# EAGLE schematic LiDAR_Lite_Interface (EAGLE 9.4.2)
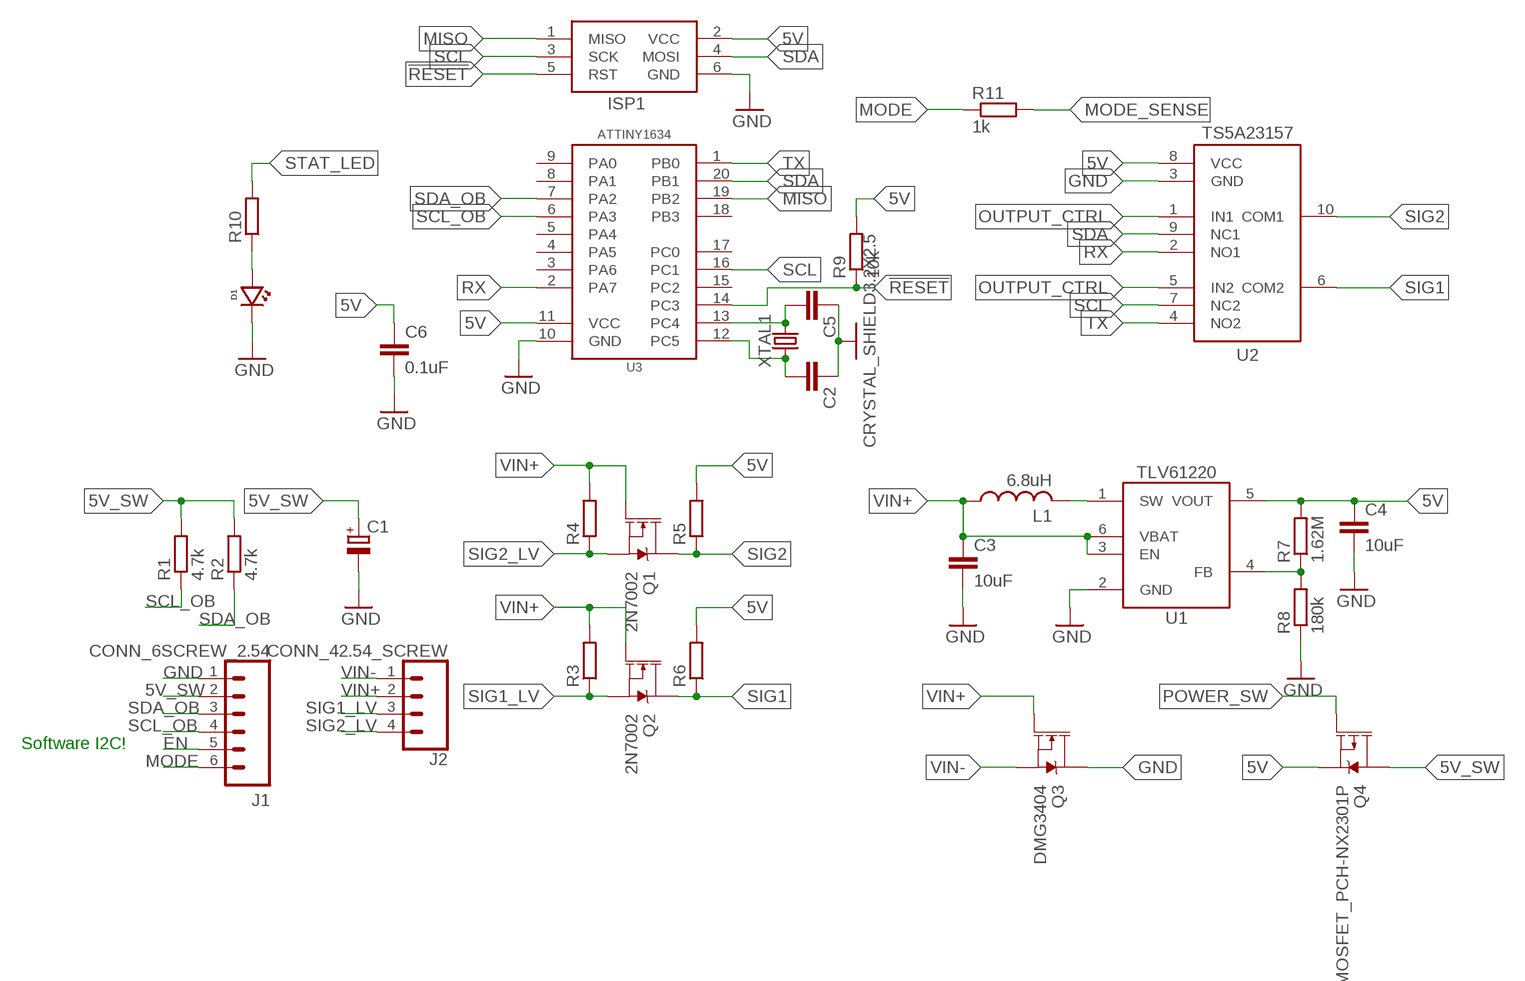
[diagram p0: schematic, sheet 1]

## Parts
C1  CPOL-EUUW-10X10  [UW-10X10_NICHICON]
C2  C-EUC0402  [C0402]
C3  10uF  C-EU10UFC0805  [C0805]
C4  10uF  C-EU10UFC0805  [C0805]
C5  C-EUC0402  [C0402]
C6  0.1uF  C-EU0.1UFC0402  [C0402]
D1  LEDBLUE0603  [LED_0603]
ISP1  AVRISP-6  [AVRISP]
J1  CONN_6SCREW_2.54  [1X06_SCREW]
J2  CONN_42.54_SCREW  [1X04_SCREW]
L1  6.8uH  INDUCTOR1008  [1008]
Q1  2N7002  MOSFET-NCH-2N7002P  [SOT23-3]
Q2  2N7002  MOSFET-NCH-2N7002P  [SOT23-3]
Q3  DMG3404  MOSFET-NCH-DMG3404L  [SOT23-3]
Q4  MOSFET_PCH-NX2301P  [SOT23-3]
R1  4.7k  R-EU_4.7KR0402  [R0402]
R2  4.7k  R-EU_4.7KR0402  [R0402]
R3  R-EU_10KR0402  [R0402]
R4  R-EU_10KR0402  [R0402]
R5  R-EU_10KR0402  [R0402]
R6  R-EU_10KR0402  [R0402]
R7  1.62M  R-EU_1.62MR0603  [R0603]
R8  180k  R-EU_180KR0603  [R0603]
R9  10k  R-EU_10KR0402  [R0402]
R10  R-EU_R0402  [R0402]
R11  1k  R-EU_1KR0402  [R0402]
U1  TLV61220DBV  [DBV_R-PDSO-G6]
U2  TS5A23157DGS  [DGS0010A]
U3  ATTINY1634SOIC  [SO-20DW]
XTAL1  CRYSTAL_SHIELD3.2X2.5  [CRYSTAL_3.2X2.5_4-SMD]

## Nets
5V: C4.1 C6.1 ISP1.2(VCC) Q4.2(S) R5.2 R6.2 R7.2 R9.2 U1.5(VOUT) U2.8(VCC) U3.11(VCC)
5V_SW: C1.+ J1.2 Q4.3(D) R1.2 R2.2
!RESET: ISP1.5(RST) R9.1 U3.14(PC3)
EN: J1.5
GND: C1.- C2.1 C3.2 C4.2 C5.1 C6.2 D1.CATHODE ISP1.6(GND) J1.1 Q3.3(D) R8.1 U1.2(GND) U2.3(GND) U3.10(GND) XTAL1.2(GND) XTAL1.4(GND)
MISO: ISP1.1(MISO) U3.19(PB2)
MODE: J1.6 R11.1
MODE_SENSE: R11.2
N$1: C5.2 U3.13(PC4) XTAL1.3
N$3: C2.2 U3.12(PC5) XTAL1.1
N$4: D1.ANODE R10.1
N$7: R7.1 R8.2 U1.4(FB)
N$9: L1.2 U1.1(SW)
OUTPUT_CTRL: U2.1(IN1) U2.5(IN2)
POWER_SW: Q4.1(G)
RX: U2.2(NO1) U3.2(PA7)
SCL: ISP1.3(SCK) U2.7(NC2) U3.16(PC1)
SCL_OB: J1.4 R1.1 U3.6(PA3)
SDA: ISP1.4(MOSI) U2.9(NC1) U3.20(PB1)
SDA_OB: J1.3 R2.1 U3.7(PA2)
SIG1: Q2.3(D) R6.1 U2.6(COM2)
SIG1_LV: J2.3 Q2.2(S) R3.1
SIG2: Q1.3(D) R5.1 U2.10(COM1)
SIG2_LV: J2.4 Q1.2(S) R4.1
STAT_LED: R10.2
TX: U2.4(NO2) U3.1(PB0)
VIN+: C3.1 J2.2 L1.1 Q1.1(G) Q2.1(G) Q3.1(G) R3.2 R4.2 U1.3(EN) U1.6(VBAT)
VIN-: J2.1 Q3.2(S)
Unconnected: U3.3(PA6) U3.4(PA5) U3.5(PA4) U3.8(PA1) U3.9(PA0) U3.15(PC2) U3.17(PC0) U3.18(PB3)

## Notes on the sheet
- Software I2C!

## Library data of the parts
C1 = bschulz_passives:CPOL-EU: POLARIZED CAPACITOR, European symbol
C2 C5 = bschulz_passives:C-EU: CAPACITOR, European symbol
C3 C4 = bschulz_passives:C-EU: CAPACITOR, European symbol; DIGIKEY: 490-6473-6-ND; MF: Murata; MPN: GRM21BR61C106KE15K
C6 = bschulz_passives:C-EU: CAPACITOR, European symbol; DIGIKEY: 490-4759-1-ND; MF: Murata; MPN: GCM155R71C104KA55D
D1 = bschulz:LED: Genaric LED; DIGIKEY: 732-4966-1-ND; MF: Wurth; MPN: 150060BS75000
ISP1 = bschulz:AVRISP: AVR ISP HEADER Standard 6 pin header for AVR programming
J1 = bschulz:CONN_6: Genaric 6 terminal header Digikey 2.54_SCREW <https://www.digikey.com/product-detail/en/on-shore-technology-inc/OSTVN06A150/ED10565-ND/1588866>; DIGIKEY: ED10565-ND; MF: OnShore; MPN: OSTVN06A150
J2 = bschulz:CONN_4: Genaric 4 terminal header Digikey 2.54_SCREW <https://www.digikey.com/product-detail/en/on-shore-technology-inc/OSTVN04A150/ED10563-ND/1588864>; DIGIKEY: ED10563-ND; MF: On Shore; MPN: OSTVN04A150
L1 = bschulz:INDUCTOR: Genaric inductor; DIGIKEY: 732-4849-1-ND; MF: Wurth; MPN: 74438323068
Q1 Q2 = bschulz:MOSFET-NCH: N-channel MOSFETs Voltage controlled devices that allow control of high current outputs. SparkFun Products: SparkFun OpenScale <https://www.sparkfun.com/products/13261> SparkFun Digital Sandbox <https://www.sparkfun.com/products/12651> SparkFun Monster Moto Shield <https://www.sparkfun.com/products/10182> SparkFun MOSFET Power Controller <https://www.sparkfun.com/products/11214>; DIGIKEY: 1727-4692-1-ND; MF: Nexperia; MPN: 2N7002P,215
Q3 = bschulz:MOSFET-NCH: N-channel MOSFETs Voltage controlled devices that allow control of high current outputs. SparkFun Products: SparkFun OpenScale <https://www.sparkfun.com/products/13261> SparkFun Digital Sandbox <https://www.sparkfun.com/products/12651> SparkFun Monster Moto Shield <https://www.sparkfun.com/products/10182> SparkFun MOSFET Power Controller <https://www.sparkfun.com/products/11214>; DIGIKEY: DMG3404L-7DICT-ND; MF: Diodes Incorporated; MPN: DMG3404L-7
Q4 = bschulz:MOSFET_PCH: P-channel MOSFETs Voltage controlled devices that allow control of high current outputs. SparkFun Products: SparkFun ESP32 Thing <https://www.sparkfun.com/products/13907> SparkFun ESP8266 Thing <https://www.sparkfun.com/products/13231>; DIGIKEY: 1727-1148-1-ND; MF: Nexperia; MPN: NX2301P,215
R1 R2 = bschulz_passives:R-EU_: RESISTOR, European symbol Digikey Parts: Yageo, 0402 <https://www.digikey.com/products/en/resistors/chip-resistor-surface-mount/52?k=&pkeyword=&sf=0&FV=ffec1104%2Cfffc000d%2C1c0002%2C440067%2C1f140000%2Cffe00034%2C400004&quantity=&ColumnSort=0&page=1&stock=1&pageSize=25> Yageo, 0603 <https://www.digikey.com/products/en/resistors/chip-resistor-surface-mount/52?k=&pkeyword=&s=4356&s=47360&sf=0&FV=fffc000d%2C1c0002%2C142c040c%2C1f140000%2Cffe00034&quantity=10&ColumnSort=1000011&page=1&stock=1&pageSize=25> Panasonic, 0603 <https://www.digikey.com/products/en/resistors/chip-resistor-surface-mount/52?k=&pkeyword=&pv252=68&sf=0&FV=ffec373d%2C1c0002%2C142c040c%2C1f140000%2Cffe00034%2C80002%2Cc0001&quantity=&ColumnSort=0&page=1&stock=1&pageSize=25> Panasonic, precision, 0603 <https://www.digikey.com/products/en/resistors/chip-resistor-surface-mount/52?FV=ffec4907%2Cfffc000a%2Cc0172%2C142c040c%2C1f140000%2Cffe00034%2C1c0002&quantity=100&ColumnSort=2085&page=1&stock=1&pageSize=25> Panasonic, 0805 <https://www.digikey.com/products/en/resistors/chip-resistor-surface-mount/52?k=&pkeyword=&pv3=1&sf=0&FV=ffec373d%2C1c0002%2C1f140000%2Cffe00034%2C142c040d&quantity=&ColumnSort=0&page=1&stock=1&pageSize=25> Rohm, current sense <https://www.digikey.com/products/en/resistors/chip-resistor-surface-mount/52?k=&pkeyword=&pv3=1&sf=0&FV=ffecb688%2C1f140000%2Cffe00034%2C1c0002&quantity=&ColumnSort=0&page=1&stock=1&pageSize=25> Vishay, pulse proof automotive <https://www.digikey.com/products/en/resistors/chip-resistor-surface-mount/52?k=&pkeyword=&pv7=2&sf=0&FV=ffec5d6b%2Cffe00034%2C1f140000&quantity=&ColumnSort=0&page=1&stock=1&pageSize=25>; DIGIKEY: 311-4.7KJRCT-ND; MF: Yageo; MPN: RC0402JR-074K7L; VALUE_PART: 4.7k
R3-R6 R9 = bschulz_passives:R-EU_: RESISTOR, European symbol Digikey Parts: Yageo, 0402 <https://www.digikey.com/products/en/resistors/chip-resistor-surface-mount/52?k=&pkeyword=&sf=0&FV=ffec1104%2Cfffc000d%2C1c0002%2C440067%2C1f140000%2Cffe00034%2C400004&quantity=&ColumnSort=0&page=1&stock=1&pageSize=25> Yageo, 0603 <https://www.digikey.com/products/en/resistors/chip-resistor-surface-mount/52?k=&pkeyword=&s=4356&s=47360&sf=0&FV=fffc000d%2C1c0002%2C142c040c%2C1f140000%2Cffe00034&quantity=10&ColumnSort=1000011&page=1&stock=1&pageSize=25> Panasonic, 0603 <https://www.digikey.com/products/en/resistors/chip-resistor-surface-mount/52?k=&pkeyword=&pv252=68&sf=0&FV=ffec373d%2C1c0002%2C142c040c%2C1f140000%2Cffe00034%2C80002%2Cc0001&quantity=&ColumnSort=0&page=1&stock=1&pageSize=25> Panasonic, precision, 0603 <https://www.digikey.com/products/en/resistors/chip-resistor-surface-mount/52?FV=ffec4907%2Cfffc000a%2Cc0172%2C142c040c%2C1f140000%2Cffe00034%2C1c0002&quantity=100&ColumnSort=2085&page=1&stock=1&pageSize=25> Panasonic, 0805 <https://www.digikey.com/products/en/resistors/chip-resistor-surface-mount/52?k=&pkeyword=&pv3=1&sf=0&FV=ffec373d%2C1c0002%2C1f140000%2Cffe00034%2C142c040d&quantity=&ColumnSort=0&page=1&stock=1&pageSize=25> Rohm, current sense <https://www.digikey.com/products/en/resistors/chip-resistor-surface-mount/52?k=&pkeyword=&pv3=1&sf=0&FV=ffecb688%2C1f140000%2Cffe00034%2C1c0002&quantity=&ColumnSort=0&page=1&stock=1&pageSize=25> Vishay, pulse proof automotive <https://www.digikey.com/products/en/resistors/chip-resistor-surface-mount/52?k=&pkeyword=&pv7=2&sf=0&FV=ffec5d6b%2Cffe00034%2C1f140000&quantity=&ColumnSort=0&page=1&stock=1&pageSize=25>; DIGIKEY: 311-10.0KHRCT-ND; MF: Yageo; MPN: RC0603FR-0710KL; VALUE_PART: 10k
R7 = bschulz_passives:R-EU_: RESISTOR, European symbol Digikey Parts: Yageo, 0402 <https://www.digikey.com/products/en/resistors/chip-resistor-surface-mount/52?k=&pkeyword=&sf=0&FV=ffec1104%2Cfffc000d%2C1c0002%2C440067%2C1f140000%2Cffe00034%2C400004&quantity=&ColumnSort=0&page=1&stock=1&pageSize=25> Yageo, 0603 <https://www.digikey.com/products/en/resistors/chip-resistor-surface-mount/52?k=&pkeyword=&s=4356&s=47360&sf=0&FV=fffc000d%2C1c0002%2C142c040c%2C1f140000%2Cffe00034&quantity=10&ColumnSort=1000011&page=1&stock=1&pageSize=25> Panasonic, 0603 <https://www.digikey.com/products/en/resistors/chip-resistor-surface-mount/52?k=&pkeyword=&pv252=68&sf=0&FV=ffec373d%2C1c0002%2C142c040c%2C1f140000%2Cffe00034%2C80002%2Cc0001&quantity=&ColumnSort=0&page=1&stock=1&pageSize=25> Panasonic, precision, 0603 <https://www.digikey.com/products/en/resistors/chip-resistor-surface-mount/52?FV=ffec4907%2Cfffc000a%2Cc0172%2C142c040c%2C1f140000%2Cffe00034%2C1c0002&quantity=100&ColumnSort=2085&page=1&stock=1&pageSize=25> Panasonic, 0805 <https://www.digikey.com/products/en/resistors/chip-resistor-surface-mount/52?k=&pkeyword=&pv3=1&sf=0&FV=ffec373d%2C1c0002%2C1f140000%2Cffe00034%2C142c040d&quantity=&ColumnSort=0&page=1&stock=1&pageSize=25> Rohm, current sense <https://www.digikey.com/products/en/resistors/chip-resistor-surface-mount/52?k=&pkeyword=&pv3=1&sf=0&FV=ffecb688%2C1f140000%2Cffe00034%2C1c0002&quantity=&ColumnSort=0&page=1&stock=1&pageSize=25> Vishay, pulse proof automotive <https://www.digikey.com/products/en/resistors/chip-resistor-surface-mount/52?k=&pkeyword=&pv7=2&sf=0&FV=ffec5d6b%2Cffe00034%2C1f140000&quantity=&ColumnSort=0&page=1&stock=1&pageSize=25>; DIGIKEY: RMCF0603FT1M62CT-ND; MF: Stackpole; MPN: RMCF0603FT1M62; VALUE_PART: 1.62M
R8 = bschulz_passives:R-EU_: RESISTOR, European symbol Digikey Parts: Yageo, 0402 <https://www.digikey.com/products/en/resistors/chip-resistor-surface-mount/52?k=&pkeyword=&sf=0&FV=ffec1104%2Cfffc000d%2C1c0002%2C440067%2C1f140000%2Cffe00034%2C400004&quantity=&ColumnSort=0&page=1&stock=1&pageSize=25> Yageo, 0603 <https://www.digikey.com/products/en/resistors/chip-resistor-surface-mount/52?k=&pkeyword=&s=4356&s=47360&sf=0&FV=fffc000d%2C1c0002%2C142c040c%2C1f140000%2Cffe00034&quantity=10&ColumnSort=1000011&page=1&stock=1&pageSize=25> Panasonic, 0603 <https://www.digikey.com/products/en/resistors/chip-resistor-surface-mount/52?k=&pkeyword=&pv252=68&sf=0&FV=ffec373d%2C1c0002%2C142c040c%2C1f140000%2Cffe00034%2C80002%2Cc0001&quantity=&ColumnSort=0&page=1&stock=1&pageSize=25> Panasonic, precision, 0603 <https://www.digikey.com/products/en/resistors/chip-resistor-surface-mount/52?FV=ffec4907%2Cfffc000a%2Cc0172%2C142c040c%2C1f140000%2Cffe00034%2C1c0002&quantity=100&ColumnSort=2085&page=1&stock=1&pageSize=25> Panasonic, 0805 <https://www.digikey.com/products/en/resistors/chip-resistor-surface-mount/52?k=&pkeyword=&pv3=1&sf=0&FV=ffec373d%2C1c0002%2C1f140000%2Cffe00034%2C142c040d&quantity=&ColumnSort=0&page=1&stock=1&pageSize=25> Rohm, current sense <https://www.digikey.com/products/en/resistors/chip-resistor-surface-mount/52?k=&pkeyword=&pv3=1&sf=0&FV=ffecb688%2C1f140000%2Cffe00034%2C1c0002&quantity=&ColumnSort=0&page=1&stock=1&pageSize=25> Vishay, pulse proof automotive <https://www.digikey.com/products/en/resistors/chip-resistor-surface-mount/52?k=&pkeyword=&pv7=2&sf=0&FV=ffec5d6b%2Cffe00034%2C1f140000&quantity=&ColumnSort=0&page=1&stock=1&pageSize=25>; DIGIKEY: P180KHCT-ND; MF: Panasonic; MPN: ERJ-3EKF1803V; VALUE_PART: 180k
R10 = bschulz_passives:R-EU_: RESISTOR, European symbol Digikey Parts: Yageo, 0402 <https://www.digikey.com/products/en/resistors/chip-resistor-surface-mount/52?k=&pkeyword=&sf=0&FV=ffec1104%2Cfffc000d%2C1c0002%2C440067%2C1f140000%2Cffe00034%2C400004&quantity=&ColumnSort=0&page=1&stock=1&pageSize=25> Yageo, 0603 <https://www.digikey.com/products/en/resistors/chip-resistor-surface-mount/52?k=&pkeyword=&s=4356&s=47360&sf=0&FV=fffc000d%2C1c0002%2C142c040c%2C1f140000%2Cffe00034&quantity=10&ColumnSort=1000011&page=1&stock=1&pageSize=25> Panasonic, 0603 <https://www.digikey.com/products/en/resistors/chip-resistor-surface-mount/52?k=&pkeyword=&pv252=68&sf=0&FV=ffec373d%2C1c0002%2C142c040c%2C1f140000%2Cffe00034%2C80002%2Cc0001&quantity=&ColumnSort=0&page=1&stock=1&pageSize=25> Panasonic, precision, 0603 <https://www.digikey.com/products/en/resistors/chip-resistor-surface-mount/52?FV=ffec4907%2Cfffc000a%2Cc0172%2C142c040c%2C1f140000%2Cffe00034%2C1c0002&quantity=100&ColumnSort=2085&page=1&stock=1&pageSize=25> Panasonic, 0805 <https://www.digikey.com/products/en/resistors/chip-resistor-surface-mount/52?k=&pkeyword=&pv3=1&sf=0&FV=ffec373d%2C1c0002%2C1f140000%2Cffe00034%2C142c040d&quantity=&ColumnSort=0&page=1&stock=1&pageSize=25> Rohm, current sense <https://www.digikey.com/products/en/resistors/chip-resistor-surface-mount/52?k=&pkeyword=&pv3=1&sf=0&FV=ffecb688%2C1f140000%2Cffe00034%2C1c0002&quantity=&ColumnSort=0&page=1&stock=1&pageSize=25> Vishay, pulse proof automotive <https://www.digikey.com/products/en/resistors/chip-resistor-surface-mount/52?k=&pkeyword=&pv7=2&sf=0&FV=ffec5d6b%2Cffe00034%2C1f140000&quantity=&ColumnSort=0&page=1&stock=1&pageSize=25>; MF: Yageo
R11 = bschulz_passives:R-EU_: RESISTOR, European symbol Digikey Parts: Yageo, 0402 <https://www.digikey.com/products/en/resistors/chip-resistor-surface-mount/52?k=&pkeyword=&sf=0&FV=ffec1104%2Cfffc000d%2C1c0002%2C440067%2C1f140000%2Cffe00034%2C400004&quantity=&ColumnSort=0&page=1&stock=1&pageSize=25> Yageo, 0603 <https://www.digikey.com/products/en/resistors/chip-resistor-surface-mount/52?k=&pkeyword=&s=4356&s=47360&sf=0&FV=fffc000d%2C1c0002%2C142c040c%2C1f140000%2Cffe00034&quantity=10&ColumnSort=1000011&page=1&stock=1&pageSize=25> Panasonic, 0603 <https://www.digikey.com/products/en/resistors/chip-resistor-surface-mount/52?k=&pkeyword=&pv252=68&sf=0&FV=ffec373d%2C1c0002%2C142c040c%2C1f140000%2Cffe00034%2C80002%2Cc0001&quantity=&ColumnSort=0&page=1&stock=1&pageSize=25> Panasonic, precision, 0603 <https://www.digikey.com/products/en/resistors/chip-resistor-surface-mount/52?FV=ffec4907%2Cfffc000a%2Cc0172%2C142c040c%2C1f140000%2Cffe00034%2C1c0002&quantity=100&ColumnSort=2085&page=1&stock=1&pageSize=25> Panasonic, 0805 <https://www.digikey.com/products/en/resistors/chip-resistor-surface-mount/52?k=&pkeyword=&pv3=1&sf=0&FV=ffec373d%2C1c0002%2C1f140000%2Cffe00034%2C142c040d&quantity=&ColumnSort=0&page=1&stock=1&pageSize=25> Rohm, current sense <https://www.digikey.com/products/en/resistors/chip-resistor-surface-mount/52?k=&pkeyword=&pv3=1&sf=0&FV=ffecb688%2C1f140000%2Cffe00034%2C1c0002&quantity=&ColumnSort=0&page=1&stock=1&pageSize=25> Vishay, pulse proof automotive <https://www.digikey.com/products/en/resistors/chip-resistor-surface-mount/52?k=&pkeyword=&pv7=2&sf=0&FV=ffec5d6b%2Cffe00034%2C1f140000&quantity=&ColumnSort=0&page=1&stock=1&pageSize=25>; DIGIKEY: 311-1.00KLRCT-ND; MF: Yageo; MPN: RC0402FR-071KL; VALUE_PART: 1k
U1 = bschulz:TLV61220: TLV61220 - Low-Input Voltage Step-Up Converter (Boost) Characteristics: Vin: 0.7V ~ 5.5V Vout: 1.8V ~ 5.5V Output Current (Max): 400 mA IQ: 5μA Operating Temperature: -40°C to 85°C Digikey: 296-30547-1-ND <https://www.digikey.com/product-detail/en/texas-instruments/TLV61220DBVR/296-30547-1-ND/3458120>; DIGIKEY: 296-30547-1-ND; MF: TI; MPN: TLV61220DBVR
U2 = bschulz:TS5A23157: TS5A23157 - 2 Channel Multiplexer DPDT Analog Switch Characteristics: VCC: 1.65~5.5V Operating Temperature: -40°C to 85°C On state resistace: 10 Ω, Typ Channel to Channel Matching: 0.15 Ω, Typical Digikey: 296-21919-1-ND (UQFN, RSE) <https://www.digikey.com/product-detail/en/texas-instruments/TS5A23157RSER/296-21919-1-ND/1629272> 296-17076-1-ND (VSSOP, DGS) <https://www.digikey.com/product-detail/en/texas-instruments/TS5A23157DGSR/296-17076-1-ND/659982>; DIGIKEY: 296-17076-1-ND; DISP: TS5A23157; MF: TI; MPN: TS5A23157DGSR
U3 = bschulz:ATTINY1634: ATtiny1634 8 bit AVR Microcontroller Features: Vcc: 1.8 ~ 5.5V Clock: Up to 16MHz, Internal 8MHz FRC, 32kHz RC Flash Memory: 16K SRAM: 1K EEPROM: 256B ADC: 10b, 12 port USART: Yes, x2 SPI: Yes I2C: Yes, slave only Notes: 2 analog comp. Digikey: ATTINY1634R-MURCT-ND (QFN) <https://www.digikey.com/product-detail/en/microchip-technology/ATTINY1634R-MUR/ATTINY1634R-MURCT-ND/3440781> ATTINY1634R-SU-ND (SOIC) <https://www.digikey.com/product-detail/en/ATTINY1634R-SU/ATTINY1634R-SU-ND/3128699/?itemSeq=272981030>; DIGIKEY: ATTINY1634-SURCT-ND; MF: Atmel; MPN: ATTINY1634-SUR
XTAL1 = bschulz:CRYSTAL_SHIELD: Crystal Oscilator w/Shield 4 Pin quartz crystal oscilators Variants 3.2x2.5mm (16MHz ~ 38.4 MHz) <https://www.digikey.com/products/en/crystals-oscillators-resonators/crystals/171?k=&pkeyword=&sv=0&pv7=2&sf=0&FV=ffe000ab%2Cffec1fd3&quantity=&ColumnSort=0&page=1&stock=1&pageSize=25>; DIGIKEY: 535-10901-1-ND; MF: Abricon; MPN: ABM8G-12.000MHZ-4Y-T3